# Altium schematic sheet FET 1 and FET 2 Isolated Gate Drive.SchDoc
size A4; SheetNumber: 1; SheetTotal: 2
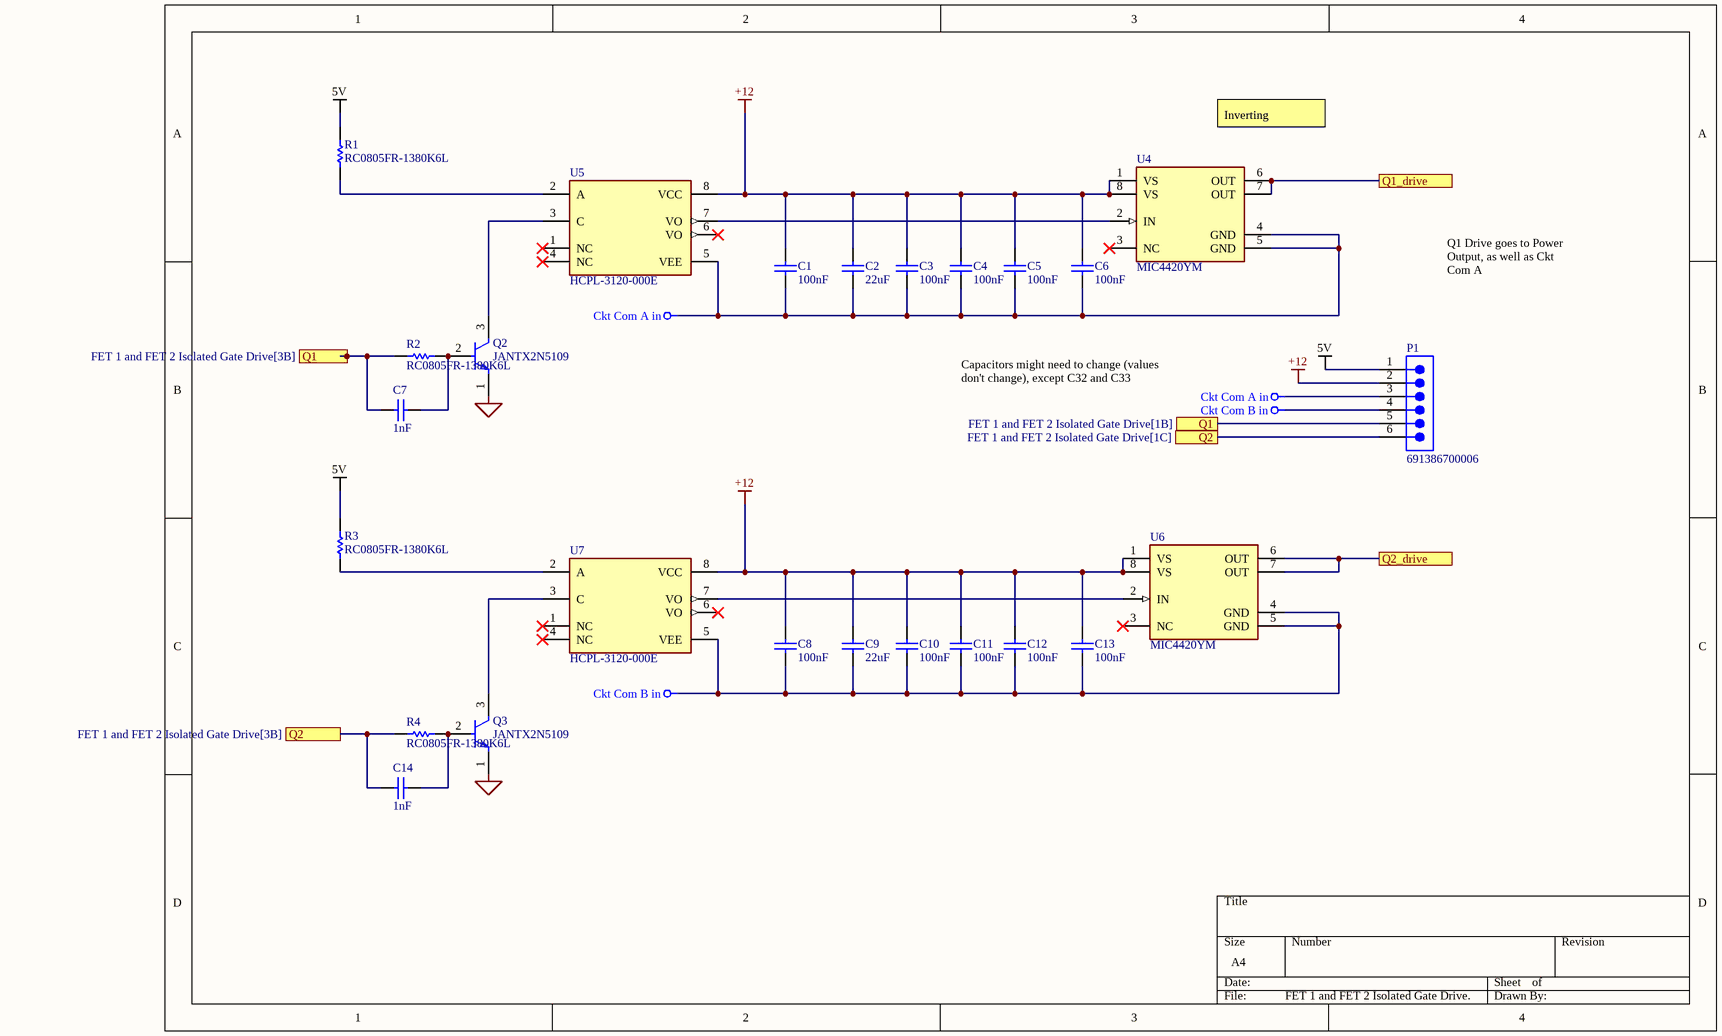
[diagram p0: FET 1 and FET 2 Isolated Gate Drive.SchDoc]

## Parts
C1  100nF  [CAPC2013X140X50ML20T25]
C2  22uF  [CAPC0805(2012)145_L]
C3  100nF  [CAPC2013X140X50ML20T25]
C4  100nF  [CAPC2013X140X50ML20T25]
C5  100nF  [CAPC2013X140X50ML20T25]
C6  100nF  [CAPC2013X140X50ML20T25]
C7  1nF  [CAPC2013X145X50LL20T20]
C8  100nF  [CAPC2013X140X50ML20T25]
C9  22uF  [CAPC0805(2012)145_L]
C10  100nF  [CAPC2013X140X50ML20T25]
C11  100nF  [CAPC2013X140X50ML20T25]
C12  100nF  [CAPC2013X140X50ML20T25]
C13  100nF  [CAPC2013X140X50ML20T25]
C14  1nF  [CAPC2013X145X50LL20T20]
P1  691386700006  [691386700006]
Q2  JANTX2N5109  [FP-TO-39-MFG]
Q3  JANTX2N5109  [FP-TO-39-MFG]
R1  RC0805FR-1380K6L  [RESC2013X60X35NL10T20]
R2  RC0805FR-1380K6L  [RESC2013X60X35NL10T20]
R3  RC0805FR-1380K6L  [RESC2013X60X35NL10T20]
R4  RC0805FR-1380K6L  [RESC2013X60X35NL10T20]
U4  MIC4420YM  [FP-SOICN-8LD-PL-1-IPC_C]
U5  HCPL-3120-000E  [FP-DIP-8-MFG]
U6  MIC4420YM  [FP-SOICN-8LD-PL-1-IPC_C]
U7  HCPL-3120-000E  [FP-DIP-8-MFG]

## Ports
Q1 (see FET 1 and FET 2 Isolated Gate Drive[1B]), Q1 (see FET 1 and FET 2 Isolated Gate Drive[3B]), Q1_drive, Q2 (see FET 1 and FET 2 Isolated Gate Drive[1C]), Q2 (see FET 1 and FET 2 Isolated Gate Drive[3B]), Q2_drive

## Nets
5V: P1.1 R1.2 R3.2
+12: C1.2 C2.2 C3.2 C4.2 C5.2 C6.2 C8.2 C9.2 C10.2 C11.2 C12.2 C13.2 P1.2 U4.1(VS) U4.8(VS) U5.8(VCC) U6.1(VS) U6.8(VS) U7.8(VCC)
Ckt Com A in: C1.1 C2.1 C3.1 C4.1 C5.1 C6.1 P1.3 U4.4(GND) U4.5(GND) U5.5(VEE)
Ckt Com B in: C8.1 C9.1 C10.1 C11.1 C12.1 C13.1 P1.4 U6.4(GND) U6.5(GND) U7.5(VEE)
GND: Q2.1(E) Q3.1(E)
Q1: C7.1 P1.5 R2.2 ; port Q1
Q1_drive: U4.6(OUT) U4.7(OUT) ; port Q1_drive
Q2: C14.1 P1.6 R4.2 ; port Q2
Q2_drive: U6.6(OUT) U6.7(OUT) ; port Q2_drive
NetC7_2: C7.2 Q2.2(B) R2.1
NetC14_2: C14.2 Q3.2(B) R4.1
NetQ2_3: Q2.3(C) U5.3(C)
NetQ3_3: Q3.3(C) U7.3(C)
NetR1_1: R1.1 U5.2(A)
NetR3_1: R3.1 U7.2(A)
NetU4_2: U4.2(IN) U5.7(VO)
NetU6_2: U6.2(IN) U7.7(VO)

Not connected (* = marked no-connect by the designer): U4 3(NC)*; U5 1(NC)* 4(NC)* 6(VO)*; U6 3(NC)*; U7 1(NC)* 4(NC)* 6(VO)*

## Notes on the sheet
- Inverting
- Q1 Drive goes to Power Output, as well as Ckt Com A
- Capacitors might need to change (values don't change), except C32 and C33

## Library data of the parts
C1 C3-C6 C8 C10-C13 = CMP-2007-04651-1: Part Number: 0805DD104KAT2A; Manufacturer: AVX Interconnect / Elco
C2 C9 = CMP-1036-04938-1: CAP 22uF 6.3V ±10% 0805 (2012 Metric) Thickness 1.45mm SMD; Tolerance: Â±10%; Case-EIA: 0805; Case-Metric: 2012; Technology: SMT; Rated Voltage: 6.3 V; Max Thickness: 1.45 mm; Value: 22uF
C7 C14 = CMP-2007-01322-1: Part Number: VJ0805Y102JXQPW1BC; Manufacturer: Vitramon
P1 = CMP-1502-02094-3: Terminal Block, 5.00MM, Male Pcb Horizontal/vertical Cab Divisible, 6 Pins; Number of Levels: 1; Number of Positions: 6; Pitch: 5.0038mm; Voltage: 300V; Current: 14A; Color: Grey; RoHS: Compliant; Max Operating Temperature: 130°C; Termination: Solder; Min Operating Temperature: -30°C; Number of Positions Per Level: 6; Mount: Through Hole; Lead Pitch: 5mm; Number of Pins: 6; Orientation: Vertical; Packaging: Box
Q2 Q3 = CMP-06366-000033-1: TRANS NPN TO39
R1-R4 = CMP-2001-01341-1: Manufacturer: Yageo; Part Number: RC0805FR-1380K6L
U4 U6 = CMP-06319-000007-1: IC GATE DRVR LOW-SIDE 8SOIC; Turn-Off Delay Time: 18ns; Output Voltage: 25mV; Supply Current: 450uA; Max Supply Voltage: 18V; Rise Time: 35ns; Number of Drivers: 1; Max Output Current: 6A; Max Power Dissipation: 1.04W; Min Supply Voltage: 4.5V; Channel Type: Single; Propagation Delay: 75ns; Output Impedance: 2.5R; Series: -; Width: 3.94mm; Length: 4.93mm; Turn-On Delay Time: 18ns; Number of Pins: 8; Min Operating Temperature: -40°C; Nominal Supply Current: 450uA; Case/Package: SOIC; Max Operating Temperature: 85°C; Package Quantity: 95; Number of Outputs: 1; Fall Time: 35ns; Packaging: Rail/Tube; Mount: Surface Mount; Output Current: 6A; Radiation Hardening: No; Height: 1.48mm; RoHS Compliant: Yes; Lead Free: Lead Free; Power Dissipation: 1.04W; REACH SVHC: No SVHC
U5 U7 = CMP-18400-000012-1: OPTOISO 3.75KV 1CH GATE DVR 8DIP; Manufacturer: Broadcom; Power Dissipation: 295mW; Turn On Delay Time: 0.3us; Min Supply Voltage: 15V; Isolation Voltage: 3750Vrms; Reverse Voltage: 5V; Forward Voltage: 1.5V; Max Supply Voltage: 30V; Forward Current: 10mA; Standoff Height: 0.51mm; Temperature Range Low: -40°C; Device Class L2: Optocouplers; Automotive: No; Mouser Description: Optocoupler; THT; Channels: 1; Out: IGBT driver; 35kV/µs; 3.75kV; Height: 4.7mm; Digikey Description: OPTOISO 3.75KV 1CH GATE DVR 8DIP; Turn Off Delay Time: 0.3us; Device Class L3: unset; Package: DIP-8; RoHS: TRUE; ComponentLink2URL: https://docs.broadcom.com/docs/AV02-0161EN; Temperature: -40°C to +100°C; Temperature Range High: +100°C; Octopart: https://octopart.com/hcpl-3120-000e-broadcom-71128428; Manufacturer Part Number: HCPL-3120-000E; Category: Trans; Device Class L1: Optoelectronics; ComponentLink2Description: Datasheet; Lead Free: Yes; Ambient Temperature Range Low: -40°C; Ambient Temperature Range High: +100°C